# Altium schematic sheet Tiny updates.SchDoc
size A4; SheetNumber: 1; SheetTotal: 1
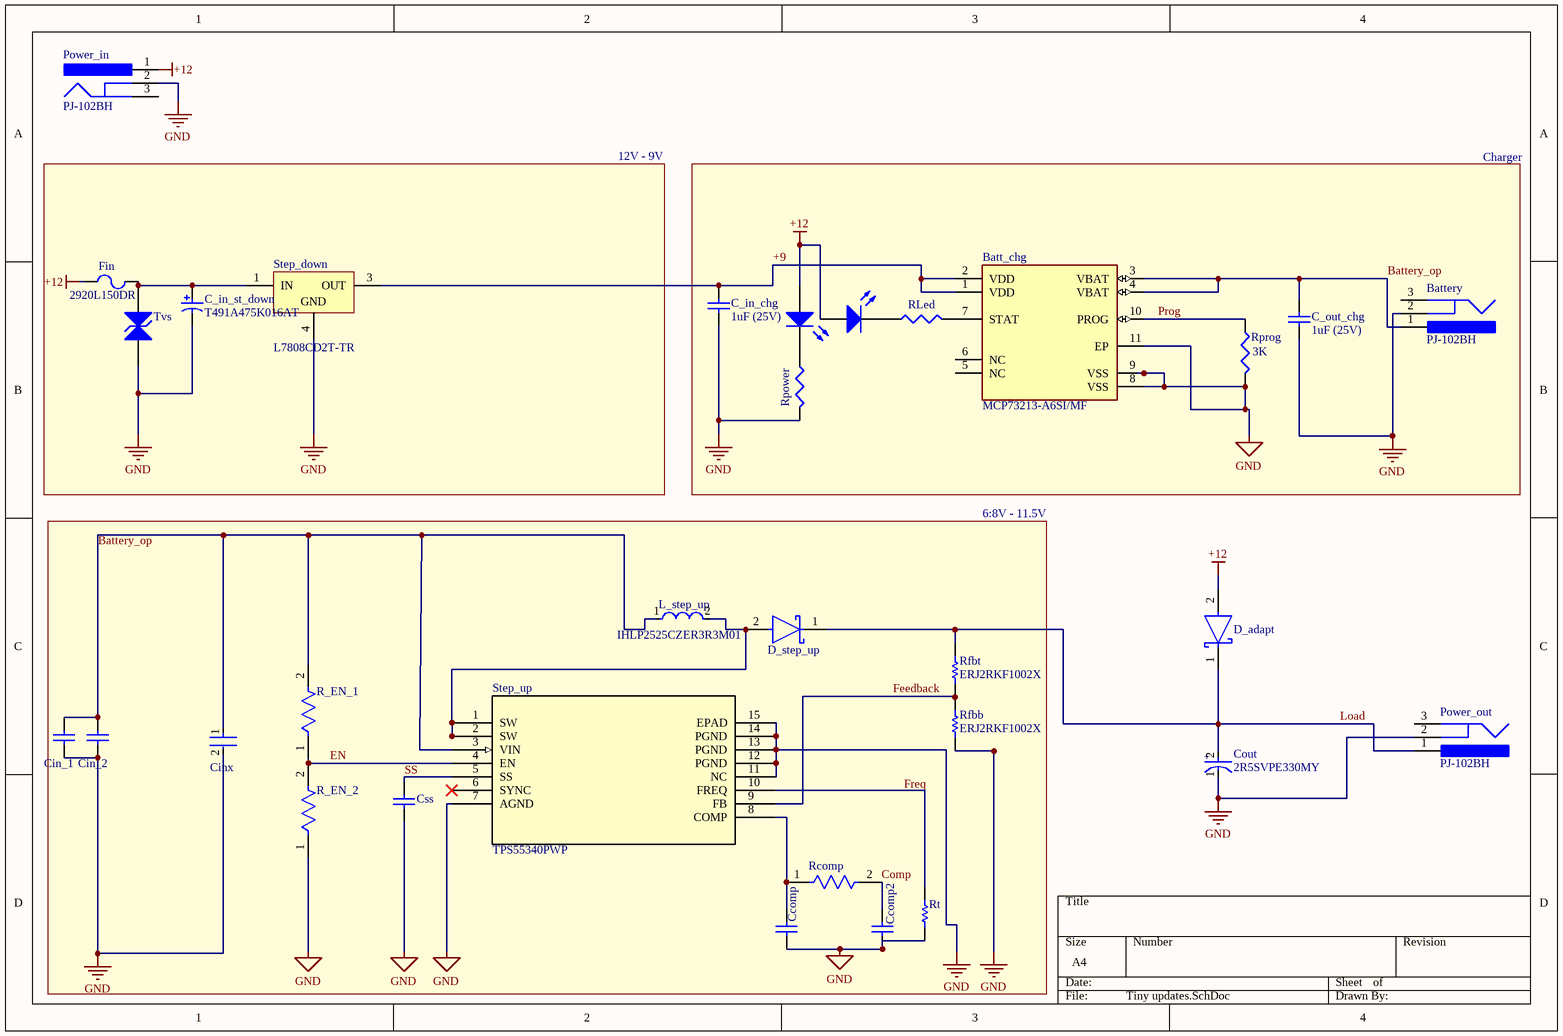
[diagram p0: Tiny updates.SchDoc]

## Parts
Batt_chg  MCP73213-A6SI/MF  [FP-C04-063-MFG]
Battery  PJ-102BH  [CUI-PJ-102BH_V]
C_in_chg  1uF (25V)  [CAPC2013X140X50LL20T25]
C_in_st_down  T491A475K016AT  [KEMT-A-3216-18-2_L]
C_out_chg  1uF (25V)  [CAPC2013X140X50LL20T25]
Ccomp  06035C102KAT2A  [CAPC1608X90X35LL15T15]  (value not drawn)
Ccomp2  06035C102KAT2A  [CAPC1608X90X35LL15T15]  (value not drawn)
Cin_1  C1206C106K4RACTU  [CAPC3216X180X50ML20T25]  (value not drawn)
Cin_2  C1206C106K4RACTU  [CAPC3216X180X50ML20T25]  (value not drawn)
Cinx  C0805C104M5RACTU  [FP-C0805C-DN-IPC_A]  (value not drawn)
Cout  2R5SVPE330MY  [FP-SVPE-B6-MFG]
Css  06035C102KAT2A  [CAPC1608X90X35LL15T15]  (value not drawn)
D_adapt  B540C-13-F  [FP-SMC-MFG]  (value not drawn)
D_chg  LED1  [LED-1]  (value not drawn)
D_step_up  B540C-13-F  [FP-SMC-MFG]  (value not drawn)
Fin  2920L150DR  [LFUS-2920L150DR_V]
L_step_up  IHLP2525CZER3R3M01  [FP-IHLP-2525CZ-FP_2_413x3-MFG]
Power_Good  LED1  [LED-1]  (value not drawn)
Power_in  PJ-102BH  [CUI-PJ-102BH_V]
Power_out  PJ-102BH  [CUI-PJ-102BH_V]
R_EN_1  RC1608F9093CS  [FP-RC1608-MFG]  (value not drawn)
R_EN_2  RC1608F9093CS  [FP-RC1608-MFG]  (value not drawn)
Rcomp  CRCW04020000Z0ED  [FP-CRCW0402-e3-IPC_C]  (value not drawn)
Rfbb  ERJ2RKF1002X  [RESC1005X40X25LL05T05]
Rfbt  ERJ2RKF1002X  [RESC1005X40X25LL05T05]
RLed  1K  [J1-0603]  (value not drawn)
Rpower  1K  [J1-0603]  (value not drawn)
Rprog  3K  [J1-0603]
Rt  CRCW08050000Z0EA  [RESC2013X50X30LL20T20]  (value not drawn)
Step_down  L7808CD2T-TR  [TO-263_N]
Step_up  TPS55340PWP  [PWP14]
Tvs  SMAJ14CA-E3/61  [VISH-DO-214AC-2_N]  (value not drawn)

## Blocks framed on the sheet
12V - 9V: C_in_st_down Fin Step_down Tvs
Charger: Batt_chg Battery C_in_chg C_out_chg D_chg Power_Good RLed Rpower Rprog
6:8V - 11.5V: Ccomp Ccomp2 Cin_1 Cin_2 Cinx Css D_step_up L_step_up R_EN_1 R_EN_2 Rcomp Rfbb Rfbt Rt Step_up

## Nets
+12: D_adapt.2(A) D_chg.1(A) Fin.1 Power_Good.1(A) Power_in.1
GND: Batt_chg.8(VSS) Batt_chg.9(VSS) Batt_chg.11(EP) Battery.2 C_in_chg.1 C_in_st_down.2 C_out_chg.1 Ccomp.1 Ccomp2.1 Cin_1.1 Cin_2.1 Cinx.2 Cout.1(C) Css.1 Power_in.2 Power_out.2 R_EN_2.1 Rfbb.1 Rpower.2 Rprog.2 Rt.1 Step_down.4(GND) Step_up.7(AGND) Step_up.11(NC) Step_up.12(PGND) Step_up.13(PGND) Step_up.14(PGND) Step_up.15(EPAD) Tvs.1(A1)
+9: Batt_chg.1(VDD) Batt_chg.2(VDD) C_in_chg.2 Step_down.3(OUT)
Battery_op: Batt_chg.3(VBAT) Batt_chg.4(VBAT) Battery.1 C_out_chg.2 Cin_1.2 Cin_2.2 Cinx.1 L_step_up.1 R_EN_1.2 Step_up.3(VIN)
Comp: Ccomp2.2 Rcomp.2
EN: R_EN_1.1 R_EN_2.2 Step_up.4(EN)
Feedback: Rfbb.2 Rfbt.1 Step_up.9(FB)
Load: Cout.2(A) D_adapt.1(C) D_step_up.1(C) Power_out.1 Rfbt.2
Prog: Batt_chg.10(PROG) Rprog.1
SS: Css.2 Step_up.5(SS)
NetBatt_chg_7: Batt_chg.7(STAT) RLed.2
NetC_in_st_down_1: C_in_st_down.1 Fin.2 Step_down.1(IN) Tvs.2(A2)
NetCcomp_2: Ccomp.2 Rcomp.1 Step_up.8(COMP)
NetD_chg_2: D_chg.2(K) RLed.1
NetD_step_up_2: D_step_up.2(A) L_step_up.2 Step_up.1(SW) Step_up.2(SW)
NetPower_Good_2: Power_Good.2(K) Rpower.1
NetRt_2: Rt.2 Step_up.10(FREQ)

Not connected (* = marked no-connect by the designer): Batt_chg 5(NC) 6(NC); Battery 3; Power_in 3; Power_out 3; Step_up 6(SYNC)*

## Notes on the sheet
- Labels drawn without touching a wire or pin: Freq
- (in symbol CMP-05428-000004-1) +

## Library data of the parts
Batt_chg = CMP-0133-00131-2: IC LI-ION/LI-POLY CTRLR 10-DFN; Number of Cells: 2; Max Input Voltage: 18V; Output Voltage: 8.4V; Max Supply Voltage: 13V; Operating Supply Current: 700uA; Drain to Source Resistance: 350mR; Max Output Current: 1.1A; Min Output Voltage: 8.15V; Voltage Rating: 8.85V; Min Supply Voltage: 4.2V; Radiation Hardening: No; Max Operating Temperature: 85°C; Mount: Surface Mount; Height: 0.037inch; REACH SVHC: No SVHC; Max Charge Current: 1.1A; Packaging: Rail/Tube; Number of Pins: 10; Package Quantity: 120; Case/Package: DFN; Max Output Voltage: 8.85V; Min Operating Temperature: -40°C; Length: 0.118inch; Number of Channels: 2; Width: 0.118inch; Lead Free: Lead Free
Battery Power_in Power_out = CMP-2000-06901-1: Through Hole Right Angle DC Power Jack, 5 A, 2.5 mm Center Pin, 3 Position, -25 to 85 degC, RoHS, Bulk; Manufacturer: CUIInc.; Outside Contact Diameter: 6.5mm; Current Rating: 5A; Brand: CUI; Insulation Resistance: 100MOhms; Inside Contact Diameter: 2.5mm; Voltage Rating: 24V; Operating Temperature Range: -25Cto+85C; Mounting Angle: Right; Mounting Technology: ThroughHole; Product Category: DCPowerConnectors; Datasheet Version: Rev. 1.02, 05/2016; Connector Type: DCPowerJack; Contact Material: Copper; Housing Material: PolybutyleneTerephthalate(PBT); Mounting Style: ThroughHole; Product: Jacks; Package Reference: PJ-102BH; Manufacturer URL: http://www.cui.com/; RoHS: True; Contact Gender: Male; Contact Plating: Nickel; Flammability Rating: UL94V-0; Factory Pack Quantity: 280; Datasheet URL: http://www.cui.com/product/resource/pj-102bh.pdf; Package Description: 3-Pin Through Hole Device, Body 14.4 x 9 mm, Height 11 mm; Termination Style: ThroughHole
C_in_chg C_out_chg = CMP-2007-03234-1: Part Number: C0805C105K3RACTU; Manufacturer: Kemet
C_in_st_down = CMP-2000-07188-1: Tantalum Capacitor, 4.7 uF, +/- 10%, 16 V, -55 to 125 degC, 2-Pin Molded, RoHS, Tape and Reel; Manufacturer: Kemet; Capacity (elec.): 4.7µF; Nominal voltage: 16V; Content: 1pc(s); Type: T491A475K016AT; Tolerance: 10%; Mounting Technology: SurfaceMount; Package Reference: 1206; Datasheet URL: https://datasheet.ciiva.com/11793/0900766b80718482-11793043.pdf; Manufacturer URL: http://www.kemet.com/; Package Description: 2-Pin Surface Mount Device, Body 3.2 x 1.6 mm; Category: Tantalumcapacitor; Datasheet Version: 08/2014
Ccomp Ccomp2 Css = CMP-2006-04378-1: Manufacturer: AVX Interconnect / Elco; Part Number: 06035C102KAT2A
Cin_1 Cin_2 = CMP-1664-00006-1: CAP, Ceramic, 10 uF, +/- 10%, 16 V, -55 to 125 degC, 1206 (3216 Metric), RoHS, Tape and Reel; Voltage Rating: 50 V; Case\Package: 0603; Type (Capacitors): C0G; Tolerance: 5%; Capacitance: 8.2 pF; Length: 1.6 mm; Mount: Surface Mount; Radiation Hardening: No; Height: 0.8 mm; RoHSCompliant: true; ComponentLink1URL: http://www.kemet.com/; REACH SVHC: No SVHC; ComponentLink1Description: Manufacturer URL; ComponentLink2Description: Datasheet; ComponentLink2URL: http://capacitoredge.kemet.com/capedge2/DataSheet/Datasheet-C1206C106K4RACTU.pdf?pn=C1206C106K4RACTU; Width: 0.8 mm; Packaging: Tape and Reel; Min Operating Temperature: -55 degC; Voltage Rating (DC): 50 V; Pins: 2; Max Operating Temperature: 125 degC; Case Code (Imperial): 0603; PackageDescription: 2-Pin Surface Mount Device, Body 3.2 x 1.6 mm; DatasheetVersion: Aug-16; Package Quantity: 4000; PackageReference: 1206; Case Code (Metric): 1608
Cinx = CMP-1036-04423-3: CAP CER 0.1UF 50V X7R 0805; Manufacturer: KEMET; Tolerance: 0.2; Temperature Coefficient: 30ppm/°C; Capacitance: 0.10 μF; Value: 0.10 μF; Temperature: -55°C to +125°C; RoHS: TRUE; Temperature Range Low: -55°C; Device Class L3: Ceramic Capacitors; Manufacturer Part Number: C0805C104M5RACTU; Octopart: https://octopart.com/c0805c104m5ractu-kemet-129379; Ipc Land Pattern Name: CAPC200125X78; Mouser Description: Multilayer Ceramic Capacitors MLCC - SMD/SMT 50volts 0.1uF X7R 20%; Temperature Range High: +125°C; Material: Ceramic; Package: C0805C-DN; Temperature Characteristic: X7R; Automotive: No; ComponentLink2URL: https://content.kemet.com/datasheets/KEM_C1003_C0G_SMD.pdf; Device Class L1: Passive Components; ComponentLink2Description: Datasheet; Device Class L2: Capacitors; Voltage Rating: 50 V; Digikey Description: CAP CER 0.1UF 50V X7R 0805; Lead Free: Yes; Height: 0.88mm; Category: Cap
Cout = CMP-05428-000004-1: CAP ALUM POLY 330UF 20% 2.5V SMD; Manufacturer: Panasonic; Leakage Current: 500uA; Dissipation Factor: 12%; Esr: 10mΩ; Life: 2000Hours; Ripple Current: 3860mA; Height: 6mm; Mouser Description: Cap Aluminum Polymer 330uF 2.5VDC 20% (5 X 5.9mm) SMD 0.01 Ohm 3860mA 2000h 105C T/R; ComponentLink2Description: Datasheet; Material: Polymer; Category: Cap; Device Class L3: Polymer Capacitors; Footprint Url: https://industrial.panasonic.com/cdbs/www-data/pdf/AAB8000/AAB8000COL10.pdf; Package: SVPE-B6; ComponentLink2URL: https://industrial.panasonic.com/cdbs/www-data/pdf/AAB8000/AAB8000C179.pdf; Value: 330uF; Temperature: -55°C to +105°C; Octopart: https://octopart.com/2r5svpe330my-panasonic-29498404; Temperature Range High: +105°C; Automotive: No; Device Class L2: Capacitors; Tolerance: 20%; Manufacturer Part Number: 2R5SVPE330MY; Digikey Description: CAP ALUM POLY 330UF 20% 2.5V SMD; Device Class L1: Passive Components; Voltage Rating: 2.5V; Capacitance: 330uF; Lead Free: Yes; RoHS: TRUE; Temperature Range Low: -55°C
D_adapt D_step_up = CMP-2000-05097-3: DIODE SCHOTTKY 40V 5A SMC; Manufacturer: Diodes Inc.; Automotive Grade: NA; Peak Reverse Current: 0.5mA; Value: 300pF; Max Junction Temp: +150°C; Max Surge Forward Current: 100A; Standoff Height: 0.1mm; Digikey Description: DIODE SCHOTTKY 40V 5A SMC; Temperature Range Low: -55°C; Manufacturer Part Number: B540C-13-F; Octopart: https://octopart.com/b540c-13-f-diodes+inc.-325873; Lead Free: Yes; Reverse Voltage: 40V; RoHS: TRUE; Category: Diode; Mouser Description: Diode: Schottky rectifying; SMD; 40V; 5A; SMC; Package: reel, tape; ComponentLink2Description: Datasheet; Temperature Range High: +150°C; Automotive: No; Footprint Url: https://www.diodes.com/assets/Package-Files/SMC.pdf; Device Class L3: Schottky Diodes; Height: 2.5mm; Forward Current: 5A; Temperature: -55°C to +150°C; Package: SMC; ComponentLink2URL: https://www.diodes.com/assets/Datasheets/ds13012.pdf; Device Class L2: Diodes; Max Repetitive Reverse Voltage: 40V; Device Class L1: Discrete Semiconductors; Capacitance: 300pF
D_chg Power_Good = LED1: Typical RED GaAs LED; Published: 8-Jun-2000; LatestRevisionDate: 08-Jul-2005; LatestRevisionNote: Mech Layer 1 removed.; PackageReference: LED-1; Publisher: Altium Limited; PackageDescription: LED; 2 Leads
Fin = CMP-2000-05549-1: Poly-Fuse(R) Resettable PTC, 33 V, 40 A, -40 to 85 degC, 2-Pin SMD, RoHS, Tape and Reel; Manufacturer: Littelfuse; Working Voltage-Max: 33V; Hold Current [Ih]: 1.5A; Trip Current: 3A; Package Description: 2-Pin Surface Mount Device, Body 5.12 x 7.355 mm; Package Reference: 2920L150DR; Mounting Technology: SurfaceMount; Manufacturer URL: http://www.littelfuse.com/; Operating Temp Range: -40to+85°C; Datasheet Version: 07/2016; Datasheet URL: http://www.littelfuse.com/~/media/electronics/datasheets/resettable_ptcs/littelfuse_ptc_2920l_datasheet.pdf.pdf; Size: 2920
L_step_up = CMP-2000-06443-2: Commercial Inductors, High Saturation Series 3.3uH 6A 30mΩ 20%; Saturation Current: 13.5A; Shielding: Shielded; Test Frequency: 100kHz; Self Resonant Frequency: 5MHz; DC Resistance (DCR): 30mR; Core Material: Metal; Termination: SMD/SMT; Inductance Tolerance: 20%; Package Quantity: 2000; Lead Free: Lead Free; Width: 6.47mm; Length: 6.47mm; Packaging: Tape and Reel; Mount: Surface Mount; RMS Current (Irms): 6A; Max Operating Temperature: 125°C; Case/Package: 2525; Max DC Current: 6A; Radiation Hardening: No; Inductance: 3.3uH; Height: 3mm; Current Rating: 6A; Min Operating Temperature: -55°C; Depth: 6.72mm; Tolerance: 20%; Military Standard: Not; Number of Pins: 2525; Height - Seated (Max): 0.118inch
R_EN_1 R_EN_2 = CMP-13261-004639-1: Res Thick Film 0603 909kΩ 1% 0.1W ±100ppm/°C Molded SMD T/R; Resistance: 909kR; Power Rating: 100mW; Voltage Rating (DC): 50V; Length: 0.063inch; Depth: 0.8mm; Packaging: Tape and Reel; Number of Terminations: 2; Composition: Thick Film; Features: Moisture Resistant; Temperature Coefficient: 100ppm/°C; Height: 0.022inch; Case Code (Metric): 1608; Max Operating Temperature: 155°C; Lead Free: Lead Free; Max Power Dissipation: 100mW; Military Standard: Not; Tolerance: 1%; Case Code (Imperial): 0603; Width: 0.031inch; Min Operating Temperature: -55°C; Case/Package: 0603; Package Quantity: 1
Rcomp = CMP-2002-08122-2: RES Thick Film, 0Ω, 0.063W, 0402; Tolerance: 5%; Max Power Dissipation: 63mW; Voltage Rating: 50V; Temperature Coefficient: 100ppm/°C; Resistance: 0mR; Contact Plating: Tin; Height: 0.35mm; Radiation Hardening: No; Features: Automotive AEC-Q200; Composition: Thick Film; Width: 0.5mm; Weight: 2.3E-05oz; Termination: SMD/SMT; Packaging: Tape and Reel; Mount: Surface Mount; Case Code (Metric): 1005; Military Standard: Not; Min Operating Temperature: -55°C; Number of Terminations: 2; Package Quantity: 1; Case Code (Imperial): 0402; Depth: 0.5mm; Max Operating Temperature: 155°C; Case/Package: 0402; Power Rating: 63mW; Lead Free: Lead Free; Voltage Rating (DC): 50V; Length: 1mm
Rfbb Rfbt = CMP-2000-07588-1: Chip Resistor, 10 KOhm, +/- 1%, 0.1 W, -55 to 155 degC, 0402 (1005 Metric), RoHS, Tape and Reel; Manufacturer: Panasonic; Power Rating: 100mW; Voltage Rating: 50V; Resistance: 10KOhm; Case\/Package: 0402; Temperature Coefficient: 100ppm\/degreesC; RoHSCompliant: True; Lead Free: LeadFree; Package Quantity: 1; Contact Plating: Tin; Length: 1mm; Radiation Hardening: No; REACH SVHC: NoSVHC; Max Operating Temperature: 155degC; Depth: 0.5mm; Case Code (Imperial): 0402; Military Standard: Not; Package Description: 2-Pin Surface Mount Device, Body 1 x 0.5 mm; Termination: SMD/SMT; Case Code (Metric): 1005; Height: 0.35mm; Packaging: TapeandReel; Voltage Rating (DC): 50V; Package Reference: 402; Number of Pins: 2; Tolerance: 1%; Mounting Technology: SurfaceMount; Width: 0.02inch; Mount: SurfaceMount; Datasheet URL: https://industrial.panasonic.com/cdbs/www-data/pdf/RDA0000/AOA0000C304.pdf; Composition: ThickFilm; Datasheet Version: 02/2017; Manufacturer URL: http://www.panasonic.com/; Max Power Dissipation: 100mW; Number of Terminations: 2; Min Operating Temperature: -55degC
RLed Rpower = Res3: Resistor; Published: 8-Jun-2000; LatestRevisionDate: 29-May-2009; LatestRevisionNote: IPC-7351 Footprint Added.; PackageReference: J1-0603; Publisher: Altium Limited; PackageDescription: Chip Resistor; Value: 1K
Rprog = Res3: Resistor; Value: 1K; Published: 8-Jun-2000; LatestRevisionDate: 29-May-2009; LatestRevisionNote: IPC-7351 Footprint Added.; PackageReference: J1-0603; Publisher: Altium Limited; PackageDescription: Chip Resistor
Rt = CMP-2001-04896-1: Manufacturer: Vishay Dale; Part Number: CRCW08050000Z0EA
Step_down = CMP-0244-00209-1: Positive Voltage Regulator, 3-Pin D2PAK, Tape and Reel; PackageVersion: 2011; PackageDescription: 3-Pin Transistor Outline Package 2.54 mm Pitch, 15.4 mm Lead Span (D2PAK); ComponentLink1URL: http://www.st.com; ComponentLink2URL: http://www.st.com/internet/com/TECHNICAL_RESOURCES/TECHNICAL_LITERATURE/DATASHEET/CD00000444.pdf; DatasheetVersion: 16/11/2011; ComponentLink1Description: Manufacturer URL; ComponentLink2Description: Datasheet; PackageReference: TO-263
Step_up = TPS55340PWP: No Description Available; Vendor: TEXAS INSTRUMENTS; Manufacturer_Part_Number: TPS55340PWP; Copyright: Copyright (C) 2018 Accelerated Designs. All rights reserved; RefDes: RefDes; Type: DEV
Tvs = CMP-0548-00182-2: Transient Voltage Suppressor, 6.40 to 231 V, 14 V Stand-off Voltage, Bi-Directional, -55 to 155 degC, 2-pin DO-214AC, Pb-Free, Tape and Reel; Manufacturer: Vishay Semiconductor; VWM (V): 14; VBR Bi-Directional (V): 6.4 to 231; ID (uA): 2; IFSM: 40 A; PPPM (W): 400, 300; ComponentLink1Description: Manufacturer URL; Operating Junction and Storage Temperature Range: -55 to 150 degC; Packing: Tape and Reel; Mounting Technology: Surface Mount; PartNumber: SMAJ14CA-E3/61; ComponentLink3URL: http://www.vishay.com/docs/88390/smaj50a.pdf; RoHS: TRUE; PackageReference: DO-214AC-2; ComponentLink2URL: http://www.vishay.com/docs/88390/smaj50a.pdf; PackageDescription: 2-Pin DO-214AC (SMA), Body 4.245 x 2.665 mm; ComponentLink1URL: http://www.vishay.com/; DatasheetVersion: 12/8/2013; ComponentLink2Description: Datasheet; ComponentLink3Description: Package Specification